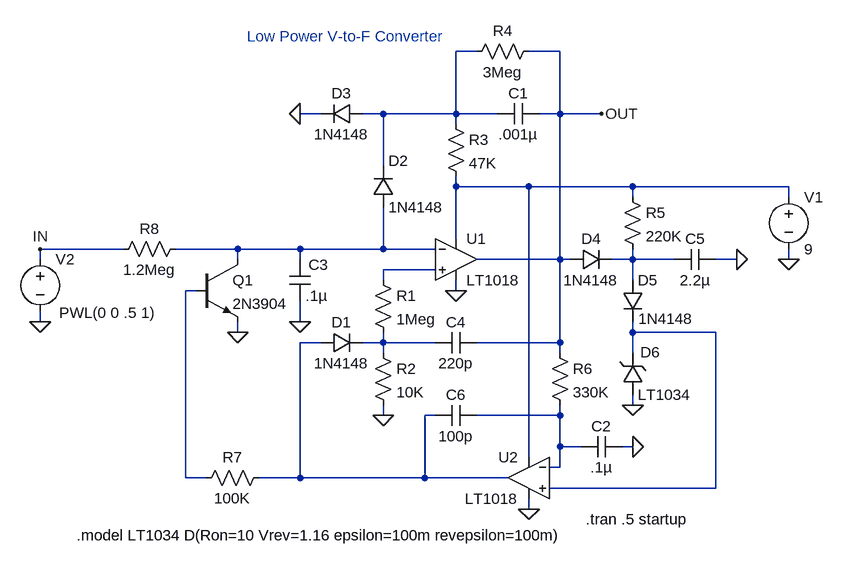
[diagram p0: schematic 1018.asc]
1018.asc, the LTspice schematic file:
Version 4
SHEET 1 1396 11024
WIRE -64 -80 -96 -80
WIRE 64 -80 16 -80
WIRE -304 16 -336 16
WIRE -208 16 -240 16
WIRE -96 16 -96 -80
WIRE -96 16 -208 16
WIRE -32 16 -96 16
WIRE 64 16 64 -80
WIRE 64 16 32 16
WIRE 128 16 64 16
WIRE -96 32 -96 16
WIRE -208 96 -208 16
WIRE -96 128 -96 112
WIRE 16 128 -96 128
WIRE 176 128 16 128
WIRE 416 128 176 128
WIRE 176 144 176 128
WIRE 416 144 416 128
WIRE -96 208 -96 128
WIRE -608 224 -736 224
WIRE -432 224 -528 224
WIRE -336 224 -432 224
WIRE -208 224 -208 160
WIRE -208 224 -336 224
WIRE -128 224 -208 224
WIRE -736 240 -736 224
WIRE -432 240 -432 224
WIRE -336 240 -336 224
WIRE 64 240 64 16
WIRE 64 240 -64 240
WIRE 80 240 64 240
WIRE 176 240 176 224
WIRE 176 240 144 240
WIRE 240 240 176 240
WIRE 336 240 304 240
WIRE 416 240 416 224
WIRE -128 256 -208 256
WIRE -208 272 -208 256
WIRE 176 272 176 240
WIRE -496 288 -512 288
WIRE -96 288 -96 272
WIRE -736 336 -736 320
WIRE -336 336 -336 304
WIRE -432 352 -432 336
WIRE 176 352 176 336
WIRE 304 352 176 352
WIRE -304 368 -336 368
WIRE -208 368 -208 352
WIRE -208 368 -240 368
WIRE -128 368 -208 368
WIRE 64 368 64 240
WIRE 64 368 -64 368
WIRE -208 384 -208 368
WIRE 64 384 64 368
WIRE 176 384 176 352
WIRE 176 464 176 448
WIRE -208 480 -208 464
WIRE -128 480 -144 480
WIRE 64 480 64 464
WIRE 64 480 -64 480
WIRE 64 528 64 480
WIRE 96 528 64 528
WIRE 176 528 160 528
WIRE 16 544 16 128
WIRE 64 560 64 528
WIRE 64 560 48 560
WIRE -512 576 -512 288
WIRE -480 576 -512 576
WIRE -336 576 -336 368
WIRE -336 576 -400 576
WIRE -144 576 -144 480
WIRE -144 576 -336 576
WIRE -16 576 -144 576
WIRE 304 592 304 352
WIRE 304 592 48 592
WIRE 16 624 16 608
FLAG 416 240 0
FLAG -96 288 0
FLAG -208 480 0
FLAG -336 16 0
FLAG 176 464 0
FLAG 16 624 0
FLAG 176 528 0
FLAG -336 336 0
FLAG -432 352 0
FLAG -736 336 0
FLAG 336 240 0
FLAG 128 16 OUT
FLAG -736 224 IN
SYMBOL voltage 416 128 R0
SYMATTR InstName V1
SYMATTR Value 9
SYMBOL Comparators\\LT1018 -96 240 R0
SYMATTR InstName U1
SYMBOL res -224 256 R0
SYMATTR InstName R1
SYMATTR Value 1Meg
SYMBOL res -224 368 R0
SYMATTR InstName R2
SYMATTR Value 10K
SYMBOL diode -304 384 R270
WINDOW 0 32 32 VTop 2
WINDOW 3 0 32 VBottom 2
SYMATTR InstName D1
SYMATTR Value 1N4148
SYMBOL diode -224 160 M180
WINDOW 0 24 72 Left 2
WINDOW 3 24 0 Left 2
SYMATTR InstName D2
SYMATTR Value 1N4148
SYMBOL res -112 16 R0
SYMATTR InstName R3
SYMATTR Value 47K
SYMBOL diode -240 0 R90
WINDOW 0 0 32 VBottom 2
WINDOW 3 32 32 VTop 2
SYMATTR InstName D3
SYMATTR Value 1N4148
SYMBOL cap 32 0 R90
WINDOW 0 0 32 VBottom 2
WINDOW 3 32 32 VTop 2
SYMATTR InstName C1
SYMATTR Value .001µ
SYMBOL res 32 -96 R90
WINDOW 0 0 56 VBottom 2
WINDOW 3 32 56 VTop 2
SYMATTR InstName R4
SYMATTR Value 3Meg
SYMBOL diode 80 256 R270
WINDOW 0 32 32 VTop 2
WINDOW 3 0 32 VBottom 2
SYMATTR InstName D4
SYMATTR Value 1N4148
SYMBOL res 160 128 R0
SYMATTR InstName R5
SYMATTR Value 220K
SYMBOL diode 160 272 R0
WINDOW 3 25 59 Left 2
SYMATTR Value 1N4148
SYMATTR InstName D5
SYMBOL zener 160 448 M180
WINDOW 0 28 65 Left 2
WINDOW 3 24 0 Left 2
SYMATTR InstName D6
SYMATTR Value LT1034
SYMATTR Description Diode
SYMATTR Type diode
SYMBOL Comparators\\LT1018 16 576 M0
SYMATTR InstName U2
SYMBOL res 48 368 R0
SYMATTR InstName R6
SYMATTR Value 330K
SYMBOL cap 160 512 R90
WINDOW 0 0 32 VBottom 2
WINDOW 3 32 32 VTop 2
SYMATTR InstName C2
SYMATTR Value .1µ
SYMBOL cap -352 304 M180
WINDOW 0 29 56 Left 2
WINDOW 3 24 8 Left 2
SYMATTR InstName C3
SYMATTR Value .1µ
SYMBOL npn -496 240 R0
SYMATTR InstName Q1
SYMATTR Value 2N3904
SYMBOL res -384 560 R90
WINDOW 0 0 56 VBottom 2
WINDOW 3 32 56 VTop 2
SYMATTR InstName R7
SYMATTR Value 100K
SYMBOL res -512 208 R90
WINDOW 0 0 56 VBottom 2
WINDOW 3 32 56 VTop 2
SYMATTR InstName R8
SYMATTR Value 1.2Meg
SYMBOL voltage -736 224 R0
WINDOW 3 29 98 Left 2
WINDOW 123 0 0 Left 2
WINDOW 39 0 0 Left 2
SYMATTR Value PWL(0 0 .5 1)
SYMATTR InstName V2
SYMBOL cap -64 352 R90
WINDOW 0 0 32 VBottom 2
WINDOW 3 32 32 VTop 2
SYMATTR InstName C4
SYMATTR Value 220p
SYMBOL cap 304 224 R90
WINDOW 0 0 32 VBottom 2
WINDOW 3 32 32 VTop 2
SYMATTR InstName C5
SYMATTR Value 2.2µ
SYMBOL cap -64 464 R90
WINDOW 0 0 32 VBottom 2
WINDOW 3 32 32 VTop 2
SYMATTR InstName C6
SYMATTR Value 100p
TEXT 104 640 Left 2 !.tran .5 startup
TEXT -680 664 Left 2 !.model LT1034 D(Ron=10 Vrev=1.16 epsilon=100m revepsilon=100m)
TEXT -264 -88 Bottom 2 ;Low Power V-to-F Converter

The netlist it stands for:
* 1018.asc
V1 N002 0 9
XU1 N005 N003 N002 0 OUT LT1018  ; pins In+ In- V+ V- OUT
R1 N005 N009 1Meg
R2 N009 0 10K
D1 N008 N009 1N4148
D2 N003 N001 1N4148
R3 N001 N002 47K
D3 N001 0 1N4148
C1 OUT N001 .001µ
R4 OUT N001 3Meg
D4 OUT N004 1N4148
R5 N002 N004 220K
D5 N004 N007 1N4148
D6 0 N007 LT1034
XU2 N007 N010 N002 0 N008 LT1018  ; pins In+ In- V+ V- OUT
R6 OUT N010 330K
C2 0 N010 .1µ
C3 0 N003 .1µ
Q1 N003 N006 0 0 2N3904
R7 N008 N006 100K
R8 N003 IN 1.2Meg
V2 IN 0 PWL(0 0 .5 1)
C4 OUT N009 220p
C5 0 N004 2.2µ
C6 N010 N008 100p
.model D D
.lib standard.dio
.model NPN NPN
.model PNP PNP
.lib standard.bjt
.tran .5 startup
.model LT1034 D(Ron=10 Vrev=1.16 epsilon=100m revepsilon=100m)
* Low Power V-to-F Converter
.lib LTC1.lib
.backanno
.end